# EAGLE design v1 (EAGLE 9.2.2)
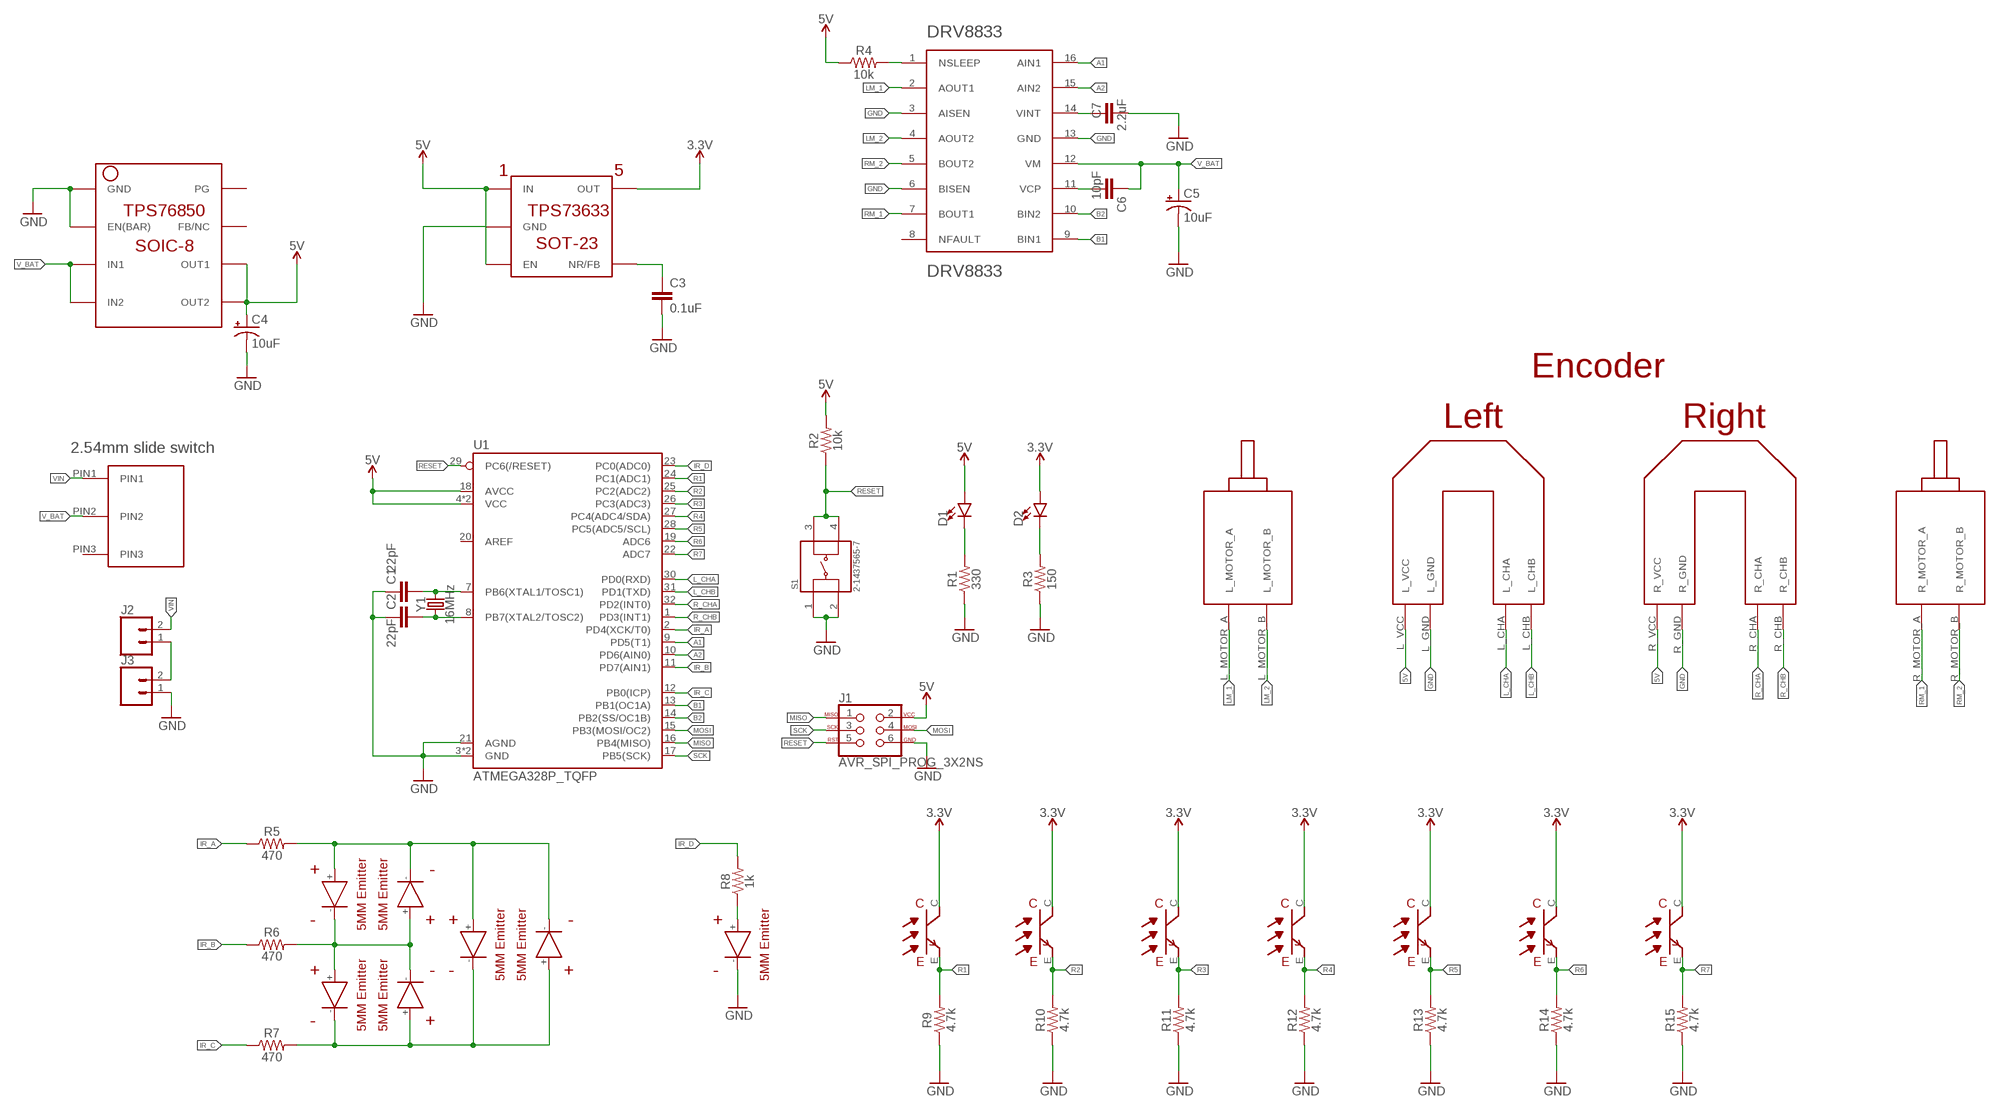
[diagram p0: schematic, sheet 1]

## Parts
C1  22pF  22PF-0603-50V-5%  [0603]
C2  22pF  22PF-0603-50V-5%  [0603]
C3  0.1uF  0.1UF-0603-25V-(+80/-20%)  [0603]
C4  10uF  10UF-POLAR-EIA3216-16V-10%(TANT)  [EIA3216]
C5  10uF  10UF-POLAR-EIA3216-16V-10%(TANT)  [EIA3216]
C6  10pF  10PF-0603-50V-5%  [0603]
C7  2.2uF  2.2UF-0603-10V-20%  [0603]
D1  LED0603  [LED-0603]
D2  LED0603  [LED-0603]
DRV8833PWP1  DRV8833  [SOP65P640X120-17N]
J1  AVR_SPI_PROG_3X2NS  [2X3-NS]
J2  CONN_02  [1X02]
J3  CONN_02  [1X02]
R1  330  330OHM-0603-1/10W-1%  [0603]
R2  10k  10KOHM-0603-1/10W-1%  [0603]
R3  150  150OHM-0603-1/10W-1%  [0603]
R4  10k  10KOHM-0603-1/10W-1%  [0603]
R5  470  470OHM-0603-1/10W-1%  [0603]
R6  470  470OHM-0603-1/10W-1%  [0603]
R7  470  470OHM-0603-1/10W-1%  [0603]
R8  1k  1KOHM-0603-1/10W-1%  [0603]
R9  4.7k  4.7KOHM-0603-1/10W-1%  [0603]
R10  4.7k  4.7KOHM-0603-1/10W-1%  [0603]
R11  4.7k  4.7KOHM-0603-1/10W-1%  [0603]
R12  4.7k  4.7KOHM-0603-1/10W-1%  [0603]
R13  4.7k  4.7KOHM-0603-1/10W-1%  [0603]
R14  4.7k  4.7KOHM-0603-1/10W-1%  [0603]
R15  4.7k  4.7KOHM-0603-1/10W-1%  [0603]
S1  2-1437565-7  [SW_2-1437565-7]
U1  ATMEGA328P_TQFP  [TQFP32-08]
U$1  TPS73633(SOT-23)  [TPS73633(SOT-23)]
U$2  TPS76850(SOIC-8)  [TPS76850(SOIC-8)]
U$3  TS02_SWITCH  [TS02_SWITCH]
U$4  FUTURA_V1.0_MOTOR_MOUNT  [FUTURA_V1.0_MOTOT_MOUNT]
U$5  EMITTER  [EMITTER]
U$6  EMITTER  [EMITTER]
U$7  EMITTER  [EMITTER]
U$8  EMITTER  [EMITTER]
U$9  EMITTER  [EMITTER]
U$10  EMITTER  [EMITTER]
U$11  EMITTER  [EMITTER]
U$12  RECEIVER  [RECEIVER]
U$13  RECEIVER  [RECEIVER]
U$14  RECEIVER  [RECEIVER]
U$15  RECEIVER  [RECEIVER]
U$16  RECEIVER  [RECEIVER]
U$17  RECEIVER  [RECEIVER]
U$18  RECEIVER  [RECEIVER]
Y1  16MHz  CRYSTAL-16MHZPTH-HC49US  [HC49US]

## Nets
3.3V: D2.A U$1.OUT U$12.C U$13.C U$14.C U$15.C U$16.C U$17.C U$18.C
5V: C4.+ D1.A J1.2 R2.2 R4.1 U1.4(VCC) U1.6(VCC) U1.18(AVCC) U$1.EN U$1.IN U$2.OUT1 U$2.OUT2 U$4.L_VCC U$4.R_VCC
A1: DRV8833PWP1.16(AIN1) U1.9(PD5(T1))
A2: DRV8833PWP1.15(AIN2) U1.10(PD6(AIN0))
B1: DRV8833PWP1.9(BIN1) U1.13(PB1(OC1A))
B2: DRV8833PWP1.10(BIN2) U1.14(PB2(SS/OC1B))
GND: C1.1 C2.1 C3.2 C4.- C5.- C7.2 DRV8833PWP1.3(AISEN) DRV8833PWP1.6(BISEN) DRV8833PWP1.13(GND) J1.6 J3.1 R1.1 R3.1 R9.1 R10.1 R11.1 R12.1 R13.1 R14.1 R15.1 S1.1 S1.2 U1.3(GND) U1.5(GND) U1.21(AGND) U$1.GND U$2.EN(BAR) U$2.GND U$4.L_GND U$4.R_GND U$11.-
IR_A: R5.1 U1.2(PD4(XCK/T0))
IR_B: R6.1 U1.11(PD7(AIN1))
IR_C: R7.1 U1.12(PB0(ICP))
IR_D: R8.2 U1.23(PC0(ADC0))
L_CHA: U1.30(PD0(RXD)) U$4.L_CHA
L_CHB: U1.31(PD1(TXD)) U$4.L_CHB
LM_1: DRV8833PWP1.2(AOUT1) U$4.L_MOTOR_A
LM_2: DRV8833PWP1.4(AOUT2) U$4.L_MOTOR_B
MISO: J1.1 U1.16(PB4(MISO))
MOSI: J1.4 U1.15(PB3(MOSI/OC2))
N$1: D1.C R1.2
N$2: C1.2 U1.7(PB6(XTAL1/TOSC1)) Y1.2
N$3: C2.2 U1.8(PB7(XTAL2/TOSC2)) Y1.1
N$4: D2.C R3.2
N$5: J2.1 J3.2
N$6: DRV8833PWP1.1(NSLEEP) R4.2
N$7: C3.1 U$1.NR/FB
N$8: R6.2 U$5.- U$6.+ U$7.+ U$8.-
N$9: R8.1 U$11.+
N$10: R5.2 U$5.+ U$7.- U$9.+ U$10.-
N$11: R7.2 U$6.- U$8.+ U$9.- U$10.+
N$16: C7.1 DRV8833PWP1.14(VINT)
N$19: C6.2 DRV8833PWP1.11(VCP)
R1: R9.2 U1.24(PC1(ADC1)) U$12.E
R2: R10.2 U1.25(PC2(ADC2)) U$13.E
R3: R11.2 U1.26(PC3(ADC3)) U$14.E
R4: R12.2 U1.27(PC4(ADC4/SDA)) U$15.E
R5: R13.2 U1.28(PC5(ADC5/SCL)) U$16.E
R6: R14.2 U1.19(ADC6) U$17.E
R7: R15.2 U1.22(ADC7) U$18.E
R_CHA: U1.32(PD2(INT0)) U$4.R_CHA
R_CHB: U1.1(PD3(INT1)) U$4.R_CHB
RESET: J1.5 R2.1 S1.3 S1.4 U1.29(PC6(/RESET))
RM_1: DRV8833PWP1.7(BOUT1) U$4.R_MOTOR_A
RM_2: DRV8833PWP1.5(BOUT2) U$4.R_MOTOR_B
SCK: J1.3 U1.17(PB5(SCK))
V_BAT: C5.+ C6.1 DRV8833PWP1.12(VM) U$2.IN1 U$2.IN2 U$3.PIN2
VIN: J2.2 U$3.PIN1
Unconnected: DRV8833PWP1.8(NFAULT) U1.20(AREF) U$2.FB/NC U$2.PG U$3.PIN3

## Library data of the parts
C1 C2 = SparkFun-Capacitors:22PF: 22pF ceramic capacitors A capacitor is a passive two-terminal electrical component used to store electrical energy temporarily in an electric field.; PROD_ID: CAP-07876
C3 = SparkFun-Capacitors:0.1UF: 0.1µF ceramic capacitors A capacitor is a passive two-terminal electrical component used to store electrical energy temporarily in an electric field.; PROD_ID: CAP-00810
C4 C5 = SparkFun-Capacitors:10UF-POLAR: 10.0µF polarized capacitors A capacitor is a passive two-terminal electrical component used to store electrical energy temporarily in an electric field.; PROD_ID: CAP-00811
C6 = SparkFun-Capacitors:10PF: 10pF ceramic capacitors A capacitor is a passive two-terminal electrical component used to store electrical energy temporarily in an electric field.; PROD_ID: CAP-11812
C7 = SparkFun-Capacitors:2.2UF: 2.2µF ceramic capacitors A capacitor is a passive two-terminal electrical component used to store electrical energy temporarily in an electric field.; PROD_ID: CAP-07888
D1 D2 = SparkFun-LED:LED: LED (Generic) Standard schematic elements and footprints for 5mm, 3mm, 1206, and 0603 sized LEDs. Generic LEDs with no color specified.
DRV8833PWP1 = DRV8833PWP:DRV8833
J1 = SparkFun-Connectors:AVR_SPI_PROG_3X2: AVR ISP 6 Pin This is the reduced ISP connector for AVR programming. Common on Arduino. This footprint will take up less PCB space and can be used with a 10-pin to 6-pin adapter such as SKU: BOB-08508 **Special note about "TEST_POINT" package. The stop mask is on the top side, so if you want your programming test points to be on the bottom of your board, make sure to place this package on the bottom side of the board. This also ensure that the orientation to program from the bottom side will be correct. SparkFun Products: SparkFun ISP Pogo Adapter <https://www.sparkfun.com/products/11591> - NS Tiny AVR Programmer <https://www.sparkfun.com/products/11801> -PTH
J2 J3 = SparkFun-Connectors:CONN_02: Multi connection point. Often used as Generic Header-pin footprint for 0.1 inch spaced/style header connections On any of the 0.1 inch spaced packages, you can populate with these: Break Away Headers - Straight <https://www.sparkfun.com/products/116> (PRT-00116) Break Away Male Headers - Right Angle <https://www.sparkfun.com/products/553> (PRT-00553) Female Headers <https://www.sparkfun.com/products/115> (PRT-00115) Break Away Headers - Machine Pin <https://www.sparkfun.com/products/117> (PRT-00117) Break Away Female Headers - Swiss Machine Pin <https://www.sparkfun.com/products/743> (PRT-00743) For SCREWTERMINALS and SPRING TERMINALS visit here: Screw Terimnals on SparkFun.com <https://www.sparkfun.com/search/results?term=Screw+Terminals> (5mm/3.5mm/2.54mm spacing) This device is also useful as a general connection point to wire up your design to another part of your project. Our various solder wires solder well into these plated through hole pads. Hook-Up Wire - Assortment (Stranded, 22 AWG) <https://www.sparkfun.com/products/11375> (PRT-11375) Hook-Up Wire - Assortment (Solid Core, 22 AWG) <https://www.sparkfun.com/products/11367> (PRT-11367) View the entire wire category on our website here <https://www.sparkfun.com/categories/141> Special notes: Molex polarized connector foot print use with: PRT-08233 with associated crimp pins and housings. 2.54_SCREWTERM for use with PRT-10571. 3.5mm Screw Terminal footprints for PRT-08084 5mm Screw Terminal footprints for use with PRT-08432
R1 = SparkFun-Resistors:330OHM: 330Ω resistor A resistor is a passive two-terminal electrical component that implements electrical resistance as a circuit element. Resistors act to reduce current flow, and, at the same time, act to lower voltage levels within circuits. - Wikipedia; PROD_ID: RES-00818
R2 R4 = SparkFun-Resistors:10KOHM: 10kΩ resistor A resistor is a passive two-terminal electrical component that implements electrical resistance as a circuit element. Resistors act to reduce current flow, and, at the same time, act to lower voltage levels within circuits. - Wikipedia; PROD_ID: RES-00824
R3 = SparkFun-Resistors:150OHM: 150Ω resistor A resistor is a passive two-terminal electrical component that implements electrical resistance as a circuit element. Resistors act to reduce current flow, and, at the same time, act to lower voltage levels within circuits. - Wikipedia; PROD_ID: RES-11028
R5-R7 = SparkFun-Resistors:470OHM: 470Ω resistor A resistor is a passive two-terminal electrical component that implements electrical resistance as a circuit element. Resistors act to reduce current flow, and, at the same time, act to lower voltage levels within circuits. - Wikipedia; PROD_ID: RES-07869
R8 = SparkFun-Resistors:1KOHM: 1kΩ resistor A resistor is a passive two-terminal electrical component that implements electrical resistance as a circuit element. Resistors act to reduce current flow, and, at the same time, act to lower voltage levels within circuits. - Wikipedia; PROD_ID: RES-07856
R9-R15 = SparkFun-Resistors:4.7KOHM: 4.7kΩ resistor A resistor is a passive two-terminal electrical component that implements electrical resistance as a circuit element. Resistors act to reduce current flow, and, at the same time, act to lower voltage levels within circuits. - Wikipedia; PROD_ID: RES-07857
S1 = 2-1437565-7:2-1437565-7: FSM2JSMA=SMT,TACTILE,PB SWITCH; MANUFACTURER: TE Connectivity; PARTREV: V; STANDARD: Manufacturer recommendations
U1 = SparkFun-IC-Microcontroller:ATMEGA328P_TQFP: Popular 328P in QFP Storefront component: ATmega328 - TQFP <https://www.sparkfun.com/products/13448> (COM-13448) Datasheet <http://www.sparkfun.com/datasheets/Components/SMD/ATMega328.pdf> SparkFun Products SparkFun RedBoard - Programmed with Arduino <https://www.sparkfun.com/products/12757> (DEV-12757) Arduino Pro Mini 328 - 5V/16MHz <https://www.sparkfun.com/products/11113> (DEV-11113) Arduino Pro Mini 328 - 3.3V/8MHz <https://www.sparkfun.com/products/11114> (DEV-11114) SparkFun OpenLog <https://www.sparkfun.com/products/13712> (DEV-13712) SparkFun MicroView - OLED Arduino Module <https://www.sparkfun.com/products/12923> (DEV-12923) SparkFun Digital Sandbox <https://www.sparkfun.com/products/12651> (DEV-12651) SparkFun PicoBoard <https://www.sparkfun.com/products/11888> (WIG-11888) Arduino Fio <https://www.sparkfun.com/products/10116> (DEV-10116) LilyPad Arduino 328 Main Board <https://www.sparkfun.com/products/13342> (DEV-13342) SparkFun RedStick <https://www.sparkfun.com/products/13741> (DEV-13741) LilyPad MP3 <https://www.sparkfun.com/products/11013> (DEV-11013) LilyPad Arduino SimpleSnap <https://www.sparkfun.com/products/10941> (DEV-10941) SparkFun Stepoko <https://www.sparkfun.com/products/13899> (ROB-13899) SparkFun Geiger Counter <https://www.sparkfun.com/products/11345> (SEN-11345) SparkFun EL Sequencer <https://www.sparkfun.com/products/12781> (COM-12781) Arduino Pro 328 - 5V/16MHz <https://www.sparkfun.com/products/10915> (DEV-10915) CryptoCape <https://www.sparkfun.com/products/12773> (DEV-12773) SparkFun IR Thermometer Evaluation Board - MLX90614 <https://www.sparkfun.com/products/10740> (SEN-10740) SparkFun RedBot Mainboard <https://www.sparkfun.com/products/12097> (ROB-12097) Arduino Pro 328 - 3.3V/8MHz <https://www.sparkfun.com/products/10914> (DEV-10914) SparkFun Block for Intel® Edison - Arduino <https://www.sparkfun.com/products/13036> (DEV-13036) SparkFun Simon Says - Surface Mount Soldering Kit <https://www.sparkfun.com/products/10935> (KIT-10935) SparkFun 7-Segment Serial Display - Red <https://www.sparkfun.com/products/11441> (COM-11441) SparkFun 7-Segment Serial Display - White <https://www.sparkfun.com/products/11629> (COM-11629) SparkFun 7-Segment Serial Display - Yellow <https://www.sparkfun.com/products/11443> (COM-11443) SparkFun 7-Segment Serial Display - Kelly Green <https://www.sparkfun.com/products/11440> (COM-11440) SparkFun 7-Segment Serial Display - Blue <https://www.sparkfun.com/products/11442> (COM-11442) SparkFun OpenSegment Serial Display - 20mm (Blue) <https://www.sparkfun.com/products/11647> (COM-11647) SparkFun OpenSegment Serial Display - 20mm (Green) <https://www.sparkfun.com/products/11646> (COM-11646) SparkFun OpenSegment Serial Display - 20mm (White) <https://www.sparkfun.com/products/11648> (COM-11648) SparkFun OpenSegment Serial Display - 20mm (Red) <https://www.sparkfun.com/products/11644> (COM-11644) SparkFun OpenSegment Serial Display - 20mm (Yellow) <https://www.sparkfun.com/products/11645> (COM-11645) SparkFun OpenSegment Shield <https://www.sparkfun.com/products/13190> (DEV-13190); PROD_ID: IC-09069
U$1 = TPS73633(SOT-23):TPS73633(SOT-23)
U$2 = TPS76850(SOIC-8):TPS76850(SOIC-8)
U$3 = 2.54mm slide switch:TS02_SWITCH
U$4 = Futura 1.0 motor mount template:FUTURA_V1.0_MOTOR_MOUNT
U$5-U$11 = sfh4550 & teft4300:EMITTER
U$12-U$18 = sfh4550 & teft4300:RECEIVER
Y1 = SparkFun-Clocks:CRYSTAL-16MHZ: 16MHz Crystal Digikey Example <http://www.digikey.com/product-search/en?keywords=535-9122-1-ND> Frequency: 16MHz Frequency Stability: ±50ppm Frequency Tolerance: ±20ppm Load Capacitance: 18pF SparkFun Products: Pro Micro -5V/16MHz <https://www.sparkfun.com/products/12640> SparkFun Serial Enabled LCD Kit <https://www.sparkfun.com/products/10097>; PROD_ID: XTAL-08181; SF_ID: COM-00536

## Board
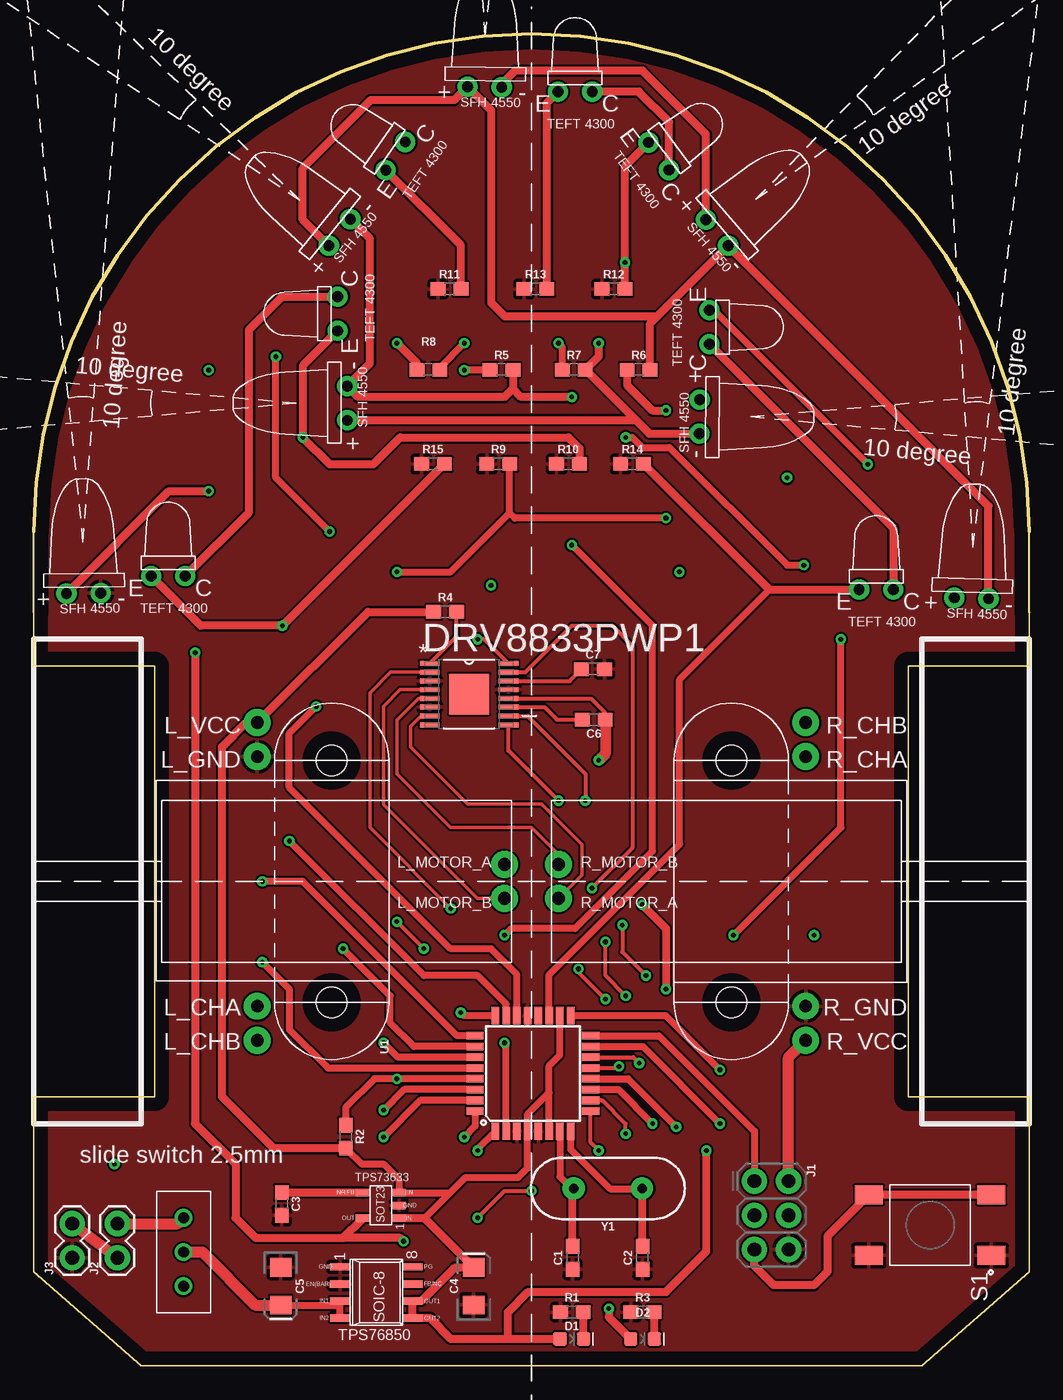
[diagram p1: board, top side]
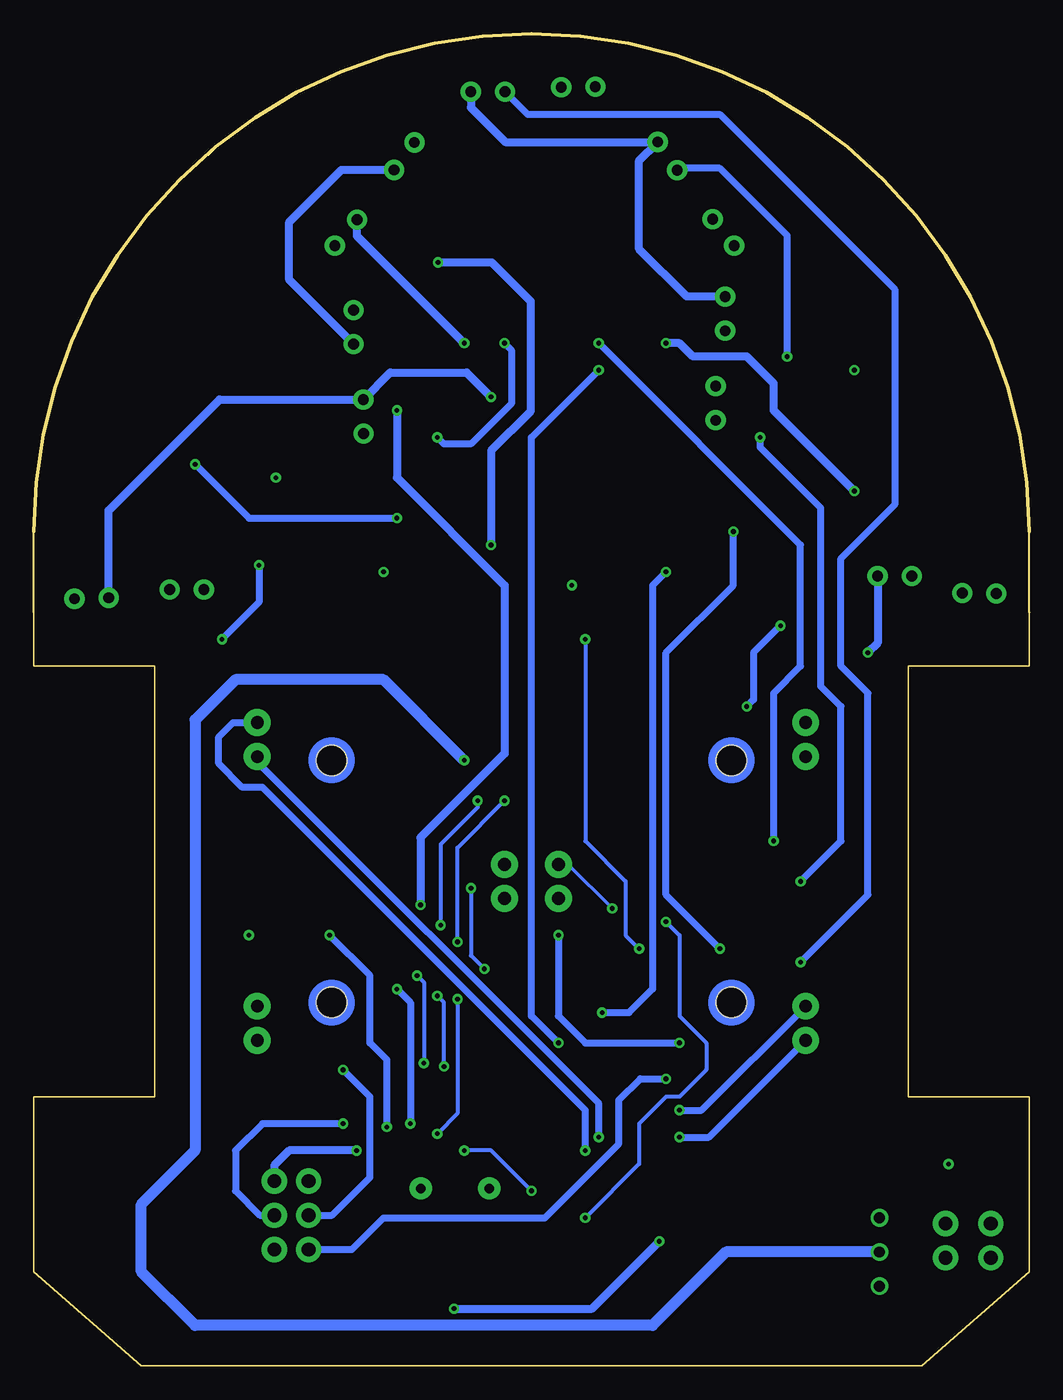
[diagram p2: board, bottom side, seen from below]

Size 74 x 99 mm. Coordinates in mm from the lower left corner, seen from the top.
Outline: 0,16 0,7 8,0 66,0 74,7 74,16
Outline: 0,56 0,62 arc-180 74,62 74,56
Copper layers (1*16): Top 0.035mm / dielectric 1.5mm / Bottom 0.035mm
Design rules "default": minimum track width 6mil, minimum drill 0.35mm, track to track 6mil, track to pad 6mil, pad to pad 6mil, via to via 6mil, smd to smd 6mil, copper to edge 40mil, drill to drill 6mil, minimum pad ring 10mil, minimum via ring 8mil, stop-mask expansion 4mil, vias tented up to drill 0mil, thermal gap 10mil

### Footprints (pad centres in the part's own frame; a part is rotated, then mirrored left to right if it is on the bottom)
0603 = smd 1.1 x 1: 1 -0.85,0; 2 0.85,0
EIA3216 = smd 1.4 x 1.6: + 1.4,0; - -1.4,0
LED-0603 = smd 1 x 1: A -0.877,0; C 0.877,0
SOP65P640X120-17N = smd 1.473 x 0.356: 1 -2.921,2.286; 2 -2.921,1.626; 3 -2.921,0.965; 4 -2.921,0.33; 5 -2.921,-0.33; 6 -2.921,-0.965; 7 -2.921,-1.626; 8 -2.921,-2.286; 9 2.921,-2.286; 10 2.921,-1.626; 11 2.921,-0.965; 12 2.921,-0.33; 13 2.921,0.33; 14 2.921,0.965; 15 2.921,1.626; 16 2.921,2.286 | smd 2.997 x 2.997: 17 0,0
2X3-NS = drill 1.016 pad 1.88: 1 -2.54,-1.27; 2 -2.54,1.27; 3 0,-1.27; 4 0,1.27; 5 2.54,-1.27; 6 2.54,1.27
1X02 = drill 1.016 pad 1.88: 1 0,0; 2 2.54,0
SW_2-1437565-7 = smd 2.1 x 1.4: 1 -4.55,2.25; 2 4.55,2.25; 3 -4.55,-2.25; 4 4.55,-2.25
TQFP32-08 = smd 1.27 x 0.559: 1 -4.293,2.8; 2 -4.293,2; 3 -4.293,1.2; 4 -4.293,0.4; 5 -4.293,-0.4; 6 -4.293,-1.2; 7 -4.293,-2; 8 -4.293,-2.8; 17 4.293,-2.8; 18 4.293,-2; 19 4.293,-1.2; 20 4.293,-0.4; 21 4.293,0.4; 22 4.293,1.2; 23 4.293,2; 24 4.293,2.8 | smd 0.559 x 1.27: 9 -2.8,-4.293; 10 -2,-4.293; 11 -1.2,-4.293; 12 -0.4,-4.293; 13 0.4,-4.293; 14 1.2,-4.293; 15 2,-4.293; 16 2.8,-4.293; 25 2.8,4.293; 26 2,4.293; 27 1.2,4.293; 28 0.4,4.293; 29 -0.4,4.293; 30 -1.2,4.293; 31 -2,4.293; 32 -2.8,4.293
TPS73633(SOT-23) = smd 0.55 x 1: EN 0.95,-1.35; GND 0,-1.35; IN -0.95,-1.35; NR/FB 0.95,1.35; OUT -0.95,1.35
TPS76850(SOIC-8) = smd 0.55 x 1.5: EN(BAR) -0.635,-2.7; FB/NC -0.635,2.7; GND -1.905,-2.7; IN1 0.635,-2.7; IN2 1.905,-2.7; OUT1 0.635,2.7; OUT2 1.905,2.7; PG -1.905,2.7
TS02_SWITCH = drill 0.8: PIN1 0,2.54; PIN2 0,0; PIN3 0,-2.54
FUTURA_V1.0_MOTOT_MOUNT = drill 0.95 pad 2: L_CHA -20.375,26.73; L_CHB -20.375,24.19; L_GND -20.375,45.27; L_MOTOR_A -2,37.27; L_MOTOR_B -2,34.73; L_VCC -20.375,47.81; R_CHA 20.375,45.27; R_CHB 20.375,47.81; R_GND 20.375,26.73; R_MOTOR_A 2,34.73; R_MOTOR_B 2,37.27; R_VCC 20.375,24.19 | hole 2.286: 14.85,45; 14.85,27; -14.85,27; -14.85,45
EMITTER = drill 0.8 pad 1.5: + -1.27,-0.5; - 1.27,-0.5
RECEIVER = drill 0.8 pad 1.5: C 1.27,-0.5; E -1.27,-0.5
HC49US = drill 0.7 pad 1.651: 1 -2.54,0; 2 2.54,0

### Placement (x,y rotation side)
C1  40.06,8.03 90 top
C2  45.25,8.03 90 top
C3  18.44,12.03 270 top
C4  32.71,5.92 90 top
C5  18.36,5.92 270 top
C6  41.63,48.03 180 top
C7  41.57,51.78 0 top
D1  40,2 0 top
D2  45.25,2 0 top
DRV8833PWP1  32.36,49.92 0 top
J1  54.84,11.19 270 top
J2  6.22,8.03 90 top
J3  2.87,8.03 90 top
R1  40,4 0 top
R2  23.2,17.03 270 top
R3  45.25,4 0 top
R4  30.58,56.03 0 top
R5  34.77,74.03 0 top
R6  44.96,74.03 0 top
R7  40.15,74.03 0 top
R8  29.34,74.03 0 top
R9  34.53,67.03 0 top
R10  39.72,67.03 0 top
R11  30.91,80.03 0 top
R12  43.1,80.03 0 top
R13  37.29,80.03 0 top
R14  44.48,67.03 0 top
R15  29.67,67.03 0 top
S1  66.63,10.46 180 top
U1  37.11,21.73 90 top
U$1  25.79,11.92 90 top
U$2  25.47,5.46 270 top
U$3  11.14,8.46 0 top
U$4  37,0 0 top
U$5  69.71,57.54 358.3 top
U$6  33.53,95.54 359.4 top
U$7  22.35,84.54 51 top
U$8  51.17,84.54 310.6 top
U$9  49.99,70.54 269.8 top
U$10  22.81,71.54 90 top
U$11  3.71,57.92 0.8 top
U$12  50.72,77.19 270 top
U$13  22.1,78.19 90 top
U$14  26.48,90.19 55.2 top
U$15  46.86,90.19 306.6 top
U$16  40.24,95.19 0 top
U$17  62.62,58.19 0 top
U$18  10,59.19 0 top
Y1  42.68,13.19 180 top

### Tracks (layer width: path | path; a pad name or v marks a point on that pad's centre or on a via)
3.3V  (via drill 0.35)
  Top 0.61: U$18.C 16,63.42 16,77 18.46,79.46 U$13.C | U$15.C 47.22,92.44 45,94.66 45,94.69 U$16.C | U$12.C 63.89,62.25 U$17.C | v12,53 12,18 15,15 15,11 16.5,9.5 23,9.5 | 23,9.5 24.44,10.94 U$1.OUT | D2.A 42.75,3.62 v42.75,4.25 | v27.5,9.25 27.25,9.5 23,9.5
  Bottom 0.61: U$13.C 25.46,79.46 29,83 29,89.56 U$14.C 38.95,90.95 41.51,93.51 U$16.C | U$12.C 55,80.7 55,85 51.13,88.87 U$15.C | U$18.C 11.27,53.73 v12,53 | v42.75,4.25 32.5,4.25 v27.5,9.25
5V  (via drill 0.35)
  Top 0.508: U1.6 38.31,20.31 | 38.31,20.31 38.31,22.31 39.11,23.11 U1.18 | 38.31,20.31 36.71,18.71 U1.4 36.71,14.71 36,14 32.09,14 30.96,12.87 | R2.2 24.38,15 26,15 27.14,13.86 U$1.EN 30.96,12.87 | 29.06,10.97 30.96,12.87
  Top 0.61: U$1.IN 29.06,10.97 C4.+ 31.32,7.32 28.83,4.82 U$2.OUT1 U$2.OUT2 29.44,3.55 31,2 35.25,2 | R4.1 24.84,56.03 U$4.L_VCC 15.81,47.81 14,46 14,20 17.82,16.18 R2.2 | 35.25,2 D1.A | 35.25,2 35.25,4 36.75,5.5 47,5.5 50,8.5 v50,16
  Top 0.813: J1.2 56.11,22.92 U$4.R_VCC
  Bottom 0.61: v50,16 55,16 56.11,14.89 J1.2
A1  (via drill 0.35)
  Top 0.305: DRV8833PWP1.16 33.49,54 v33,54 | v29,31 v27,33 | v33,11 35,13 v37,13 | v42,16 41.4,16.6 U1.9
  Bottom 0.305: v33,54 33,39 30,36 30,32 v29,31 | v27,33 26,32 26,26 24,24 24,22 26,20 27,20 29,18 29,15 v33,11 | v37,13 40,16 v42,16
A2  (via drill 0.35)
  Top 0.305: U1.10 42.27,19.73 44,18 v44,17.25 | DRV8833PWP1.15 36.55,51.55 40,55 43,55 44.5,53.5 44.5,38.5 v41.5,35.5 | v40.5,29.5 40.5,29.25 v42.5,27.25
  Bottom 0.305: v40.5,29.5 41.5,30.5 v41.5,35.5 | v42.5,27.25 42.5,18.75 v44,17.25
B1  (via drill 0.35)
  Top 0.305: U1.13 43.38,22.13 v43.5,22.25 | v44,27.5 42.5,29 v42.5,31.5 | v39,42 35.28,45.72 DRV8833PWP1.9
  Bottom 0.305: v43.5,22.25 43.5,27 v44,27.5 | v42.5,31.5 42.5,38.5 v39,42
B2  (via drill 0.35)
  Top 0.305: U1.14 44.57,22.93 v45,22.5 | DRV8833PWP1.10 36.71,48.29 41,44 v41,42 | v43.75,32.75 43.75,30.75 v45.5,29
  Bottom 0.305: v41,42 41,41.5 43.75,38.75 v43.75,32.75 | v45.5,29 45,28.5 v45,22.5
GND
  pour Top: -4,-4 -4,109 83,109 83,-5
IR_A  (via drill 0.35)
  Top 0.508: U1.2 35.11,23.89 v35,24 | v32,74 32.03,74.03 R5.1
  Bottom 0.508: v35,24 37,26 37,69 v32,74
IR_B  (via drill 0.35)
  Top 0.508: v46,18 43.47,20.53 U1.11
  Top 0.61: R6.1 44.11,72.89 46,71 v47,71 | v45.25,34.25 47,32.5 v47,28
  Bottom 0.508: v46,18 46,27 v47,28
  Bottom 0.61: v47,71 47,66 39,58 39,45.5 45.25,39.25 v45.25,34.25
IR_C  (via drill 0.35)
  Top 0.508: U1.12 44.17,21.33 v47.75,17.75 | v52,32 60,40 v60,54 | R7.1 39.3,75.7 v39,76 | v44,69 44.5,69 45.25,68.25 47.25,68.25 56,59.5 v57.25,59.5
  Bottom 0.508: v52,32 49,29 49,24 47.75,22.75 v47.75,17.75 | v39,76 38.5,75.5 38.5,71.5 41.5,68.5 43.5,68.5 v44,69 | v57.25,59.5 57.25,56.75 v60,54
IR_D  (via drill 0.35)
  Top 0.508: U1.23 35.11,26.89 33,29 29,29 v19,39 | v32,76 30.19,74.19 R8.2
  Bottom 0.508: v19,39 19,50 17,52 17,61 v32,76
L_CHA  (via drill 0.35)
  Top 0.508: U1.30 27.53,20.53 v26,19
  Bottom 0.508: v26,19 24.36,19 U$4.L_CHA
L_CHB  (via drill 0.35)
  Top 0.508: U1.31 28.73,19.73 v26,17
  Bottom 0.508: v26,17 23.81,17 U$4.L_CHB
LM_1  (via drill 0.35)
  Top 0.254: DRV8833PWP1.2 26.55,51.55 25,50 25,40 v31,34
  Bottom 0.254: v31,34 34.27,37.27 U$4.L_MOTOR_A
LM_2
  Top 0.254: U$4.L_MOTOR_B 33,34.73 26,41.73 26,49 27.25,50.25 DRV8833PWP1.4
MISO
  Top 0.508: U1.16 46.47,24.53 53.57,17.43 J1.1
MOSI  (via drill 0.35)
  Top 0.508: U1.15 45.27,23.73 v51,18
  Bottom 0.508: J1.4 57.19,11.19 59,13 59,16 57,18 v51,18
N$1
  Top 0.61: D1.C 40.88,3.97 R1.2
N$2
  Top 0.508: U1.7 39.11,14.06 40.06,13.11
  Top 0.61: C1.2 40.06,13.11 Y1.2
N$3
  Top 0.508: U1.8 39.91,16.09 42.84,13.16 45.25,13.16
  Top 0.61: C2.2 45.25,13.16 Y1.1
N$4
  Top 0.61: D2.C 46.13,3.97 R3.2
N$5
  Top 0.813: J2.1 J3.2
N$6
  Top 0.305: DRV8833PWP1.1 31.43,54.2 R4.2
N$7
  Top 0.61: C3.1 U$1.NR/FB
N$8
  Top 0.61: R6.2 45.81,77.44 46.37,78 | 46.37,78 U$8.- 70.97,63.9 U$5.- | U$7.+ 20,85.18 20,89 25.05,94.05 31.25,94.05 U$6.+ 34,93.31 34,79 35,78 46.37,78
N$9  (via drill 0.35)
  Top 0.61: U$11.+ 10.05,65 v13,65 | v27,76 28.49,74.51 R8.1
  Bottom 0.61: v13,65 19,71 19,73 21,75 25,75 26,76 v27,76
N$10  (via drill 0.35)
  Top 0.61: R5.2 35.62,72.62 | 35.62,72.62 35,72 24.12,72 U$10.- 25,74.5 25,83.75 U$7.- | v40,72 36.24,72 35.62,72.62
  Bottom 0.61: U$5.+ 68.43,63.57 60.19,71.81 U$9.+ 47.49,73.81 41.81,73.81 v40,72
N$11  (via drill 0.35)
  Top 0.61: 44.76,70.27 R7.2 42,75.03 v42,76 | 44.76,70.27 45.76,69.27 U$9.- | U$8.+ 49.96,91.54 45.25,96.25 35.77,96.25 34.8,95.28 U$6.- | U$10.+ 44.76,70.27
  Bottom 0.61: v42,76 49.96,83.96 U$8.+
N$16
  Top 0.305: DRV8833PWP1.14 39.83,50.89 C7.1
N$19
  Top 0.305: DRV8833PWP1.11 37.95,48.95 38.88,48.03 C6.2
R1  (via drill 0.35)
  Top 0.508: U1.24 31.98,26.02 v31.75,26.25 | v27,59 31,59 35.38,63.38 | 35.38,63.38 R9.2 | U$12.E 50.54,78.46 v62,67 | v47,63 35.76,63 35.38,63.38
  Bottom 0.508: v27,59 28,58 28,28 29.75,26.25 v31.75,26.25 | v62,67 58,63 v47,63
R2  (via drill 0.35)
  Top 0.508: U1.25 31.47,24.53 20,36 v17,36
  Top 0.61: U$13.E 20,74.32 v20,69 22,67 25.25,67 27.25,69 39.75,69 40.57,68.18 R10.2
  Bottom 0.508: v17,36 14,39 14,49 15.5,50.5 15.5,63.75 20,68.25 v20,69
R3  (via drill 0.35)
  Top 0.508: U1.26 28.27,23.73 26.5,25.5 26.5,27.5 v23,31 | v22,62 18,66 v18,75
  Top 0.61: R11.2 31.76,83.27 U$14.E
  Bottom 0.508: v23,31 27,35 27,53 22,58 v22,62 | v18,75 18,84 23,89 26.03,89 U$14.E
R4  (via drill 0.35)
  Top 0.508: U1.27 27.07,22.93 v26,24 | v35,32 35.5,32.5 40.25,32.5 46,38.25 46,55 v40,61
  Top 0.61: R12.2 v43.95,82 43.95,89.16 U$15.E
  Bottom 0.508: v35,32 35,26 33,24 v26,24
  Bottom 0.61: v40,61 40,68 37.05,70.95 37.05,79.1 39.95,82 v43.95,82
R5  (via drill 0.35)
  Top 0.508: v17,30 19,28 19,25 21.87,22.13 U1.28
  Top 0.61: R13.2 38.14,93.86 U$16.E
  Bottom 0.508: U$16.E 37.28,93 23,93 10,80 10,64 14,60 14,52 12,50 12,35 v17,30
R6
  Top 0.508: U1.19 38.31,29.06 48,38.75 48,51 54.69,57.69 55,57.69
  Top 0.61: R14.2 54.67,57.69 55,57.69 U$17.E
R7  (via drill 0.35)
  Top 0.508: U1.22 35.91,29.09 34,31 31,31 19,43 19,47 v21,49
  Top 0.61: R15.2 v18.49,55 12.42,55 U$18.E
  Bottom 0.508: v21,49 20.49,49.51 20.49,53 v18.49,55
R_CHA  (via drill 0.35)
  Top 0.508: U1.32 32.82,17.82 v32,17
  Bottom 0.508: v32,17 32,19.5 57.38,44.88 U$4.R_CHA
R_CHB  (via drill 0.35)
  Top 0.508: U1.1 33,16.13 v33,16
  Bottom 0.508: v33,16 33,19 57,43 58.5,43 60.25,44.75 60.25,46.75 59.19,47.81 U$4.R_CHB
RESET  (via drill 0.35)
  Top 0.508: U1.29 v27,21.33 25.33,21.33 23.2,19.2 R2.1
  Top 0.61: S1.3 S1.4 59,9.63 59,7 58,6 55,6 53.57,7.43 J1.5
  Bottom 0.508: J1.5 50.35,8.65 48,11 36,11 30.5,16.5 30.5,19.75 28.92,21.33 v27,21.33
RM_1
  Top 0.254: U$4.R_MOTOR_A 40.75,36.48 40.75,38.75 37.75,41.75 32.25,41.75 28,46 28,47.5 28.79,48.29 DRV8833PWP1.7
RM_2
  Top 0.254: DRV8833PWP1.5 28.59,49.59 27,48 27,44 31,40 37,40 39,38 U$4.R_MOTOR_B
S$1  (via drill 0.35)
  other vias: 6,15
S$2  (via drill 0.35)
  other vias: 58,32
S$3  (via drill 0.35)
  other vias: 34,58
S$4  (via drill 0.35)
  other vias: 13,74
S$5  (via drill 0.35)
  other vias: 56,66
S$6  (via drill 0.35)
  other vias: 48,59
SCK  (via drill 0.35)
  Top 0.508: v51,22 46.98,26.02 U1.17
  Bottom 0.508: J1.3 51.81,11.19 49,14 49,20 v51,22
V_BAT  (via drill 0.35)
  Top 0.305: DRV8833PWP1.12 41.41,49.59 42.48,48.52 C6.1
  Top 0.508: C5.+ 22.47,4.52 U$2.IN1 U$2.IN2
  Top 0.813: U$3.PIN2 12.54,8.46 16.48,4.52 C5.+ | C6.1 42.48,45.48 v42,45
  Bottom 0.813: U$3.PIN2 22.54,8.46 28,3 62,3 66,7 66,12 62,16 62,48 59,51 48,51 v42,45
VIN
  Top 0.813: J2.2 10.71,10.57 U$3.PIN1